# EAGLE design main-v2 (EAGLE 6.5.0)
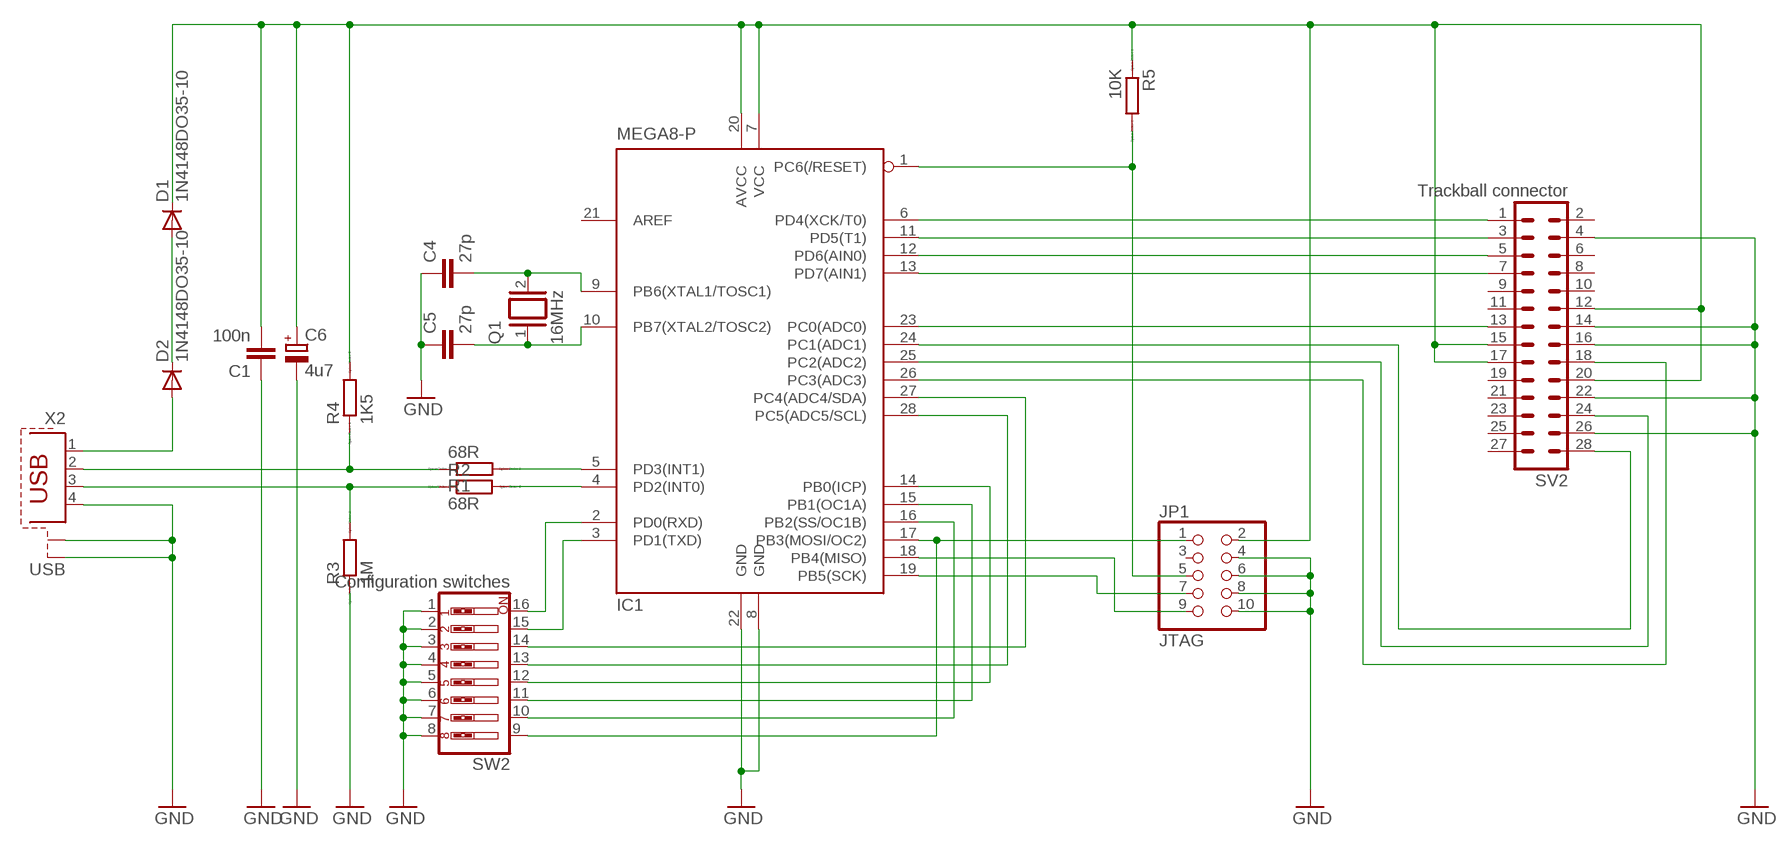
[diagram p0: schematic, sheet 1]

## Parts
C1  100n  C-EU025-025X050  [C025-025X050]
C4  27p  C-EU025-025X050  [C025-025X050]
C5  27p  C-EU025-025X050  [C025-025X050]
C6  4u7  CPOL-EUE2.5-5  [E2,5-5]
D1  1N4148DO35-10  [DO35-10]
D2  1N4148DO35-10  [DO35-10]
IC1  MEGA8-P  [DIL28-3]
JP1  JTAG  PINHD-2X5  [2X05]
Q1  16MHz  XTAL/S  [QS]
R1  68R  R0207/10  [0207/10]
R2  68R  R0207/10  [0207/10]
R3  1M  R0207/10  [0207/10]
R4  1K5  R0207/10  [0207/10]
R5  10K  R0207/10  [0207/10]
SV2  Trackball connector  MA14-214  [MA14-2]
SW2  Configuration switches  SW_DIP-8  [EDG-08]
X2  USB  PN61729-S  [PN61729-S]

## Nets
GND: C1.1 C4.1 C5.1 C6.- IC1.8(GND) IC1.22(GND) JP1.4 JP1.6 JP1.8 JP1.10 R3.1 SV2.4 SV2.14 SV2.16 SV2.22 SV2.26 SW2.1 SW2.2 SW2.3 SW2.4 SW2.5 SW2.6 SW2.7 SW2.8 X2.4 X2.S1 X2.S2
N$1: D1.A D2.C
N$3: IC1.5(PD3(INT1)) R1.2
N$4: IC1.4(PD2(INT0)) R2.2
N$5: R1.1 R4.1 X2.2
N$6: R2.1 R3.2 X2.3
N$8: IC1.12(PD6(AIN0)) SV2.5
N$9: C5.2 IC1.10(PB7(XTAL2/TOSC2)) Q1.1
N$10: C4.2 IC1.9(PB6(XTAL1/TOSC1)) Q1.2
N$12: IC1.11(PD5(T1)) SV2.3
N$13: IC1.6(PD4(XCK/T0)) SV2.1
N$14: IC1.23(PC0(ADC0)) SV2.13
N$15: IC1.13(PD7(AIN1)) SV2.7
N$16: IC1.25(PC2(ADC2)) SV2.24
N$17: IC1.26(PC3(ADC3)) SV2.18
N$18: IC1.1(PC6(/RESET)) JP1.5 R5.2
N$19: IC1.18(PB4(MISO)) JP1.9
N$20: IC1.19(PB5(SCK)) JP1.7
N$21: IC1.17(PB3(MOSI/OC2)) JP1.1 SW2.9
N$28: IC1.24(PC1(ADC1)) SV2.28
N$49: D2.A X2.1
N$50: IC1.16(PB2(SS/OC1B)) SW2.10
N$51: IC1.15(PB1(OC1A)) SW2.11
N$52: IC1.14(PB0(ICP)) SW2.12
N$53: IC1.2(PD0(RXD)) SW2.16
N$54: IC1.3(PD1(TXD)) SW2.15
N$55: IC1.27(PC4(ADC4/SDA)) SW2.14
N$56: IC1.28(PC5(ADC5/SCL)) SW2.13
VCC: C1.2 C6.+ D1.C IC1.7(VCC) IC1.20(AVCC) JP1.2 R4.2 R5.1 SV2.12 SV2.15 SV2.17 SV2.20
Unconnected: IC1.21(AREF) JP1.3 SV2.2 SV2.6 SV2.8 SV2.9 SV2.10 SV2.11 SV2.19 SV2.21 SV2.23 SV2.25 SV2.27

## Library data of the parts
C1 C4 C5 = rcl:C-EU: CAPACITOR, European symbol
C6 = rcl:CPOL-EU: POLARIZED CAPACITOR, European symbol
D1 D2 = diode:1N4148: DIODE high speed (Philips)
IC1 = atmel-mt:MEGA8-P: MICROCONTROLLER 8 Kbytes FLASH, 1 kbytes SRAM, 512 bytes EEPROM, USART, 4-channel 10 bit ADC, 2-channel 8 bit ADC Pin compatible with Atmega48, ATMega88, ATMega168 Source: avr.lbr; OC_FARNELL: unknown; OC_NEWARK: unknown
JP1 = pinhead:PINHD-2X5: PIN HEADER
Q1 = special:XTAL/S: CRYSTAL
R1-R5 = eagle-ltspice:R: RESISTOR, European symbol; SPICEMODEL: NONE; SPICEPREFIX: R
SV2 = con-lstb:MA14-2: PIN HEADER; OC_FARNELL: unknown; OC_NEWARK: unknown
SW2 = special:SW_DIP-8: DIP SWITCH
X2 = con-berg:PN61729-S: BERG USB connector; OC_FARNELL: unknown; OC_NEWARK: unknown

## Net classes
0 default: clearance 0.205 mm

## Board
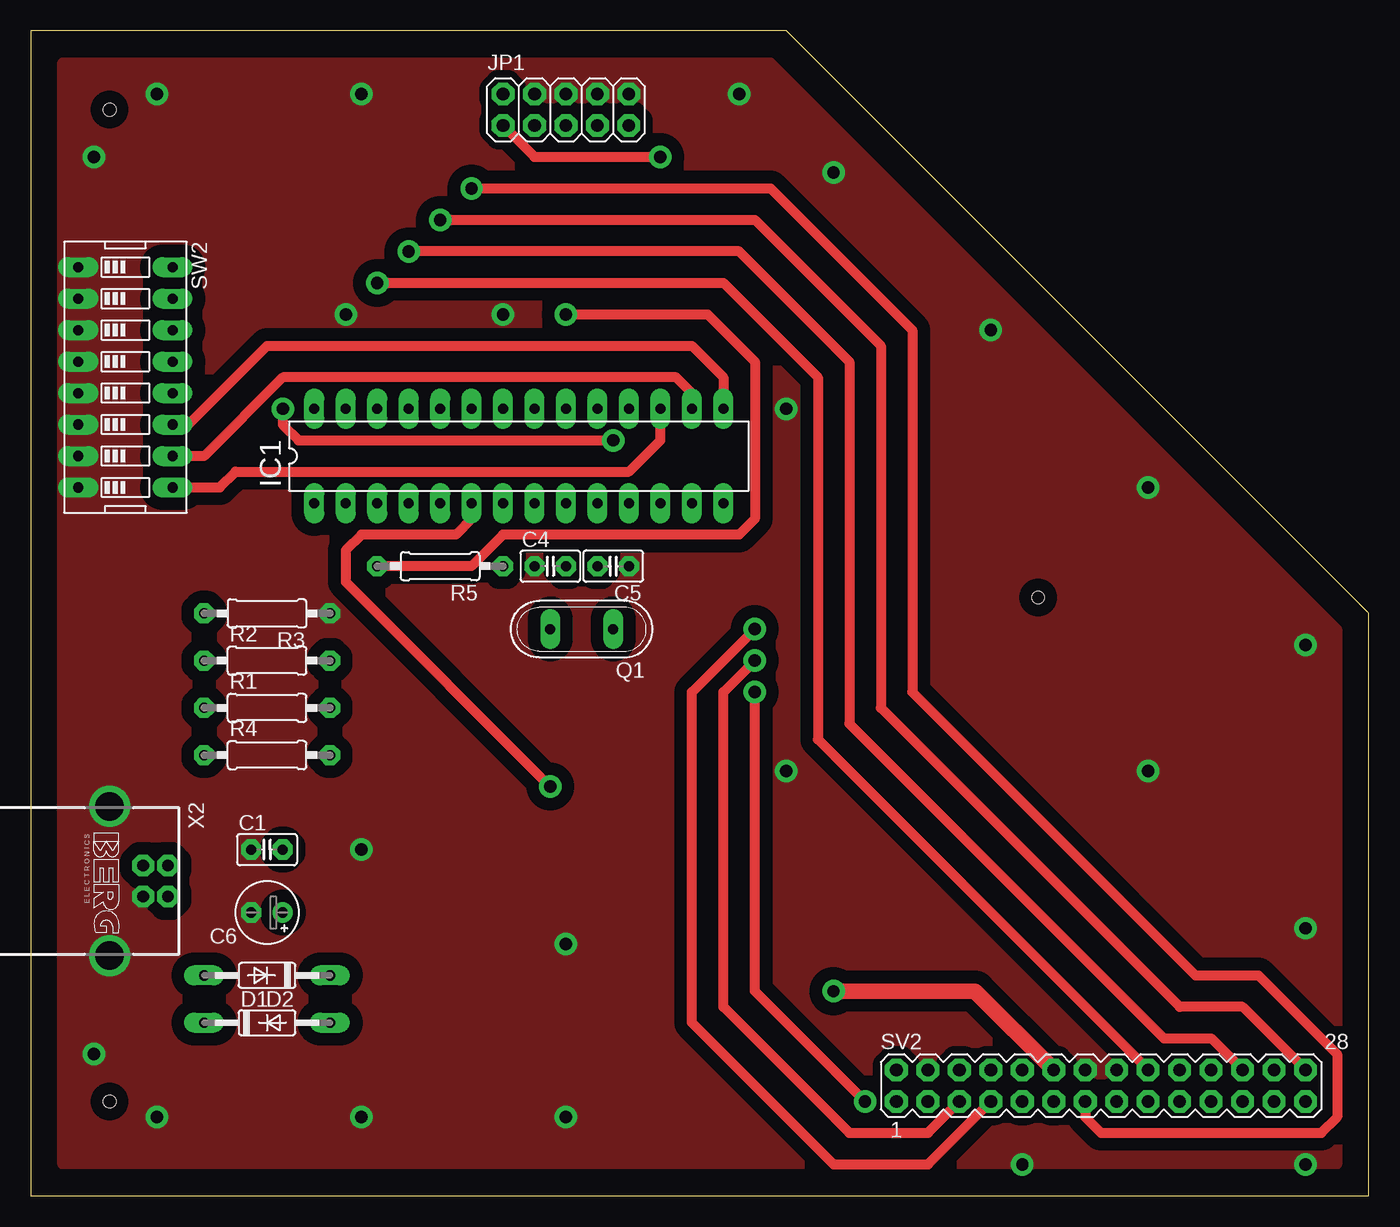
[diagram p1: board, top side]
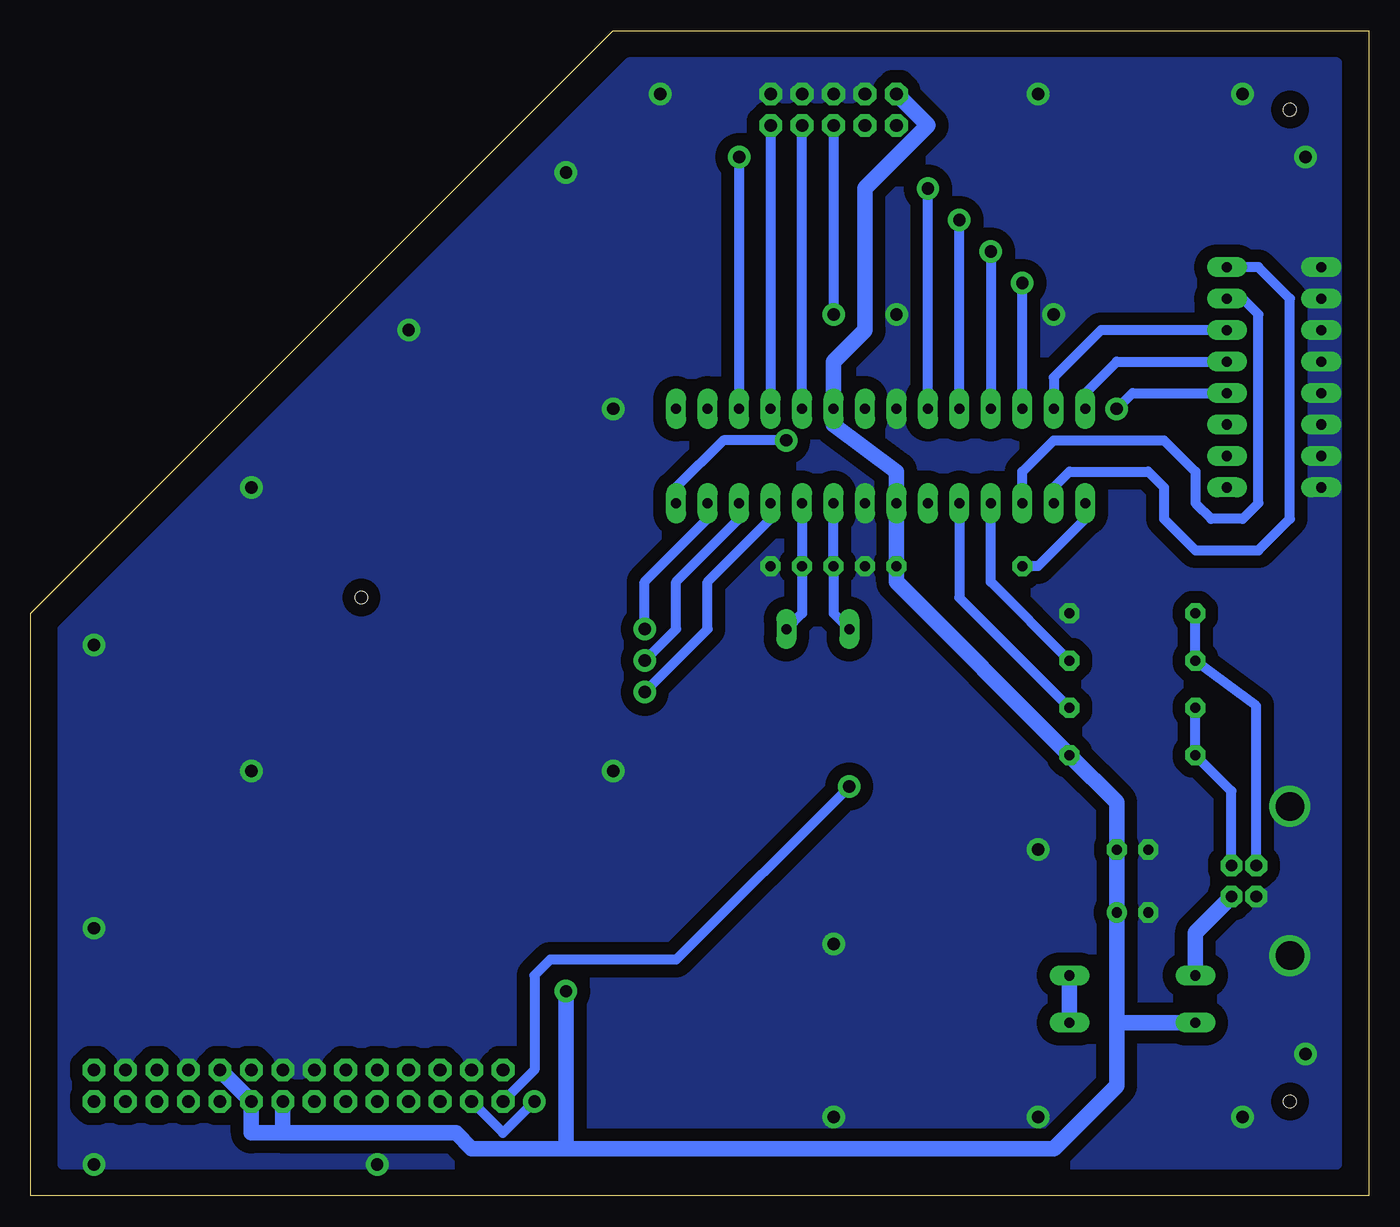
[diagram p2: board, bottom side, seen from below]

Size 107.95 x 93.98 mm. Coordinates in mm from the lower left corner, seen from the top.
Outline: 0,0 107.95,0 107.95,46.99 60.96,93.98 0,93.98 0,0
Copper layers (1*16): Top 0.035mm / dielectric 1.5mm / Bottom 0.035mm
Design rules "default *": minimum track width 10mil, minimum drill 0.8mm, track to track 8mil, track to pad 8mil, pad to pad 8mil, via to via 8mil, smd to smd 8mil, copper to edge 40mil, drill to drill 8mil, minimum pad ring 16mil, minimum via ring 16mil, stop-mask expansion 4mil, vias tented up to drill 0mil, thermal gap 10mil
Holes 1 mm at 6.35,87.63 6.35,7.62 81.28,48.26

### Footprints (pad centres in the part's own frame; a part is rotated, then mirrored left to right if it is on the bottom)
C025-025X050 = drill 0.813 octagon: 1 -1.27,0; 2 1.27,0
E2,5-5 = drill 0.813 pad 1.6: + -1.27,0 | drill 0.813 pad 1.6 octagon: - 1.27,0
DO35-10 = drill 0.813 long: A 5.08,0; C -5.08,0
DIL28-3 = drill 0.813 long: 1 -16.51,-3.81; 2 -13.97,-3.81; 3 -11.43,-3.81; 4 -8.89,-3.81; 5 -6.35,-3.81; 6 -3.81,-3.81; 7 -1.27,-3.81; 8 1.27,-3.81; 9 3.81,-3.81; 10 6.35,-3.81; 11 8.89,-3.81; 12 11.43,-3.81; 13 13.97,-3.81; 14 16.51,-3.81; 15 16.51,3.81; 16 13.97,3.81; 17 11.43,3.81; 18 8.89,3.81; 19 6.35,3.81; 20 3.81,3.81; 21 1.27,3.81; 22 -1.27,3.81; 23 -3.81,3.81; 24 -6.35,3.81; 25 -8.89,3.81; 26 -11.43,3.81; 27 -13.97,3.81; 28 -16.51,3.81
2X05 = drill 1.016 octagon: 1 -5.08,-1.27; 2 -5.08,1.27; 3 -2.54,-1.27; 4 -2.54,1.27; 5 0,-1.27; 6 0,1.27; 7 2.54,-1.27; 8 2.54,1.27; 9 5.08,-1.27; 10 5.08,1.27
QS = drill 0.8 long: 1 -2.54,0; 2 2.54,0
0207/10 = drill 0.813 octagon: 1 -5.08,0; 2 5.08,0
MA14-2 = drill 1.016 octagon: 1 -16.51,-1.27; 2 -16.51,1.27; 3 -13.97,-1.27; 4 -13.97,1.27; 5 -11.43,-1.27; 6 -11.43,1.27; 7 -8.89,-1.27; 8 -8.89,1.27; 9 -6.35,-1.27; 10 -6.35,1.27; 11 -3.81,-1.27; 12 -3.81,1.27; 13 -1.27,-1.27; 14 -1.27,1.27; 15 1.27,-1.27; 16 1.27,1.27; 17 3.81,-1.27; 18 3.81,1.27; 19 6.35,-1.27; 20 6.35,1.27; 21 8.89,-1.27; 22 8.89,1.27; 23 11.43,-1.27; 24 11.43,1.27; 25 13.97,-1.27; 26 13.97,1.27; 27 16.51,-1.27; 28 16.51,1.27
EDG-08 = drill 0.813 long: 1 -8.89,-3.81; 2 -6.35,-3.81; 3 -3.81,-3.81; 4 -1.27,-3.81; 5 1.27,-3.81; 6 3.81,-3.81; 7 6.35,-3.81; 8 8.89,-3.81; 9 8.89,3.81; 10 6.35,3.81; 11 3.81,3.81; 12 1.27,3.81; 13 -1.27,3.81; 14 -3.81,3.81; 15 -6.35,3.81; 16 -8.89,3.81
PN61729-S = drill 0.95 octagon: 1 1.25,4.71; 2 -1.25,4.71; 3 -1.25,2.71; 4 1.25,2.71 | drill 2.3 pad 2.9: S1 -6.02,0; S2 6.02,0

### Placement (x,y rotation side)
C1  19.05,27.94 0 top
C4  41.91,50.8 0 top
C5  46.99,50.8 180 top
C6  19.05,22.86 180 top
D1  19.05,13.97 0 top
D2  19.05,17.78 180 top
IC1  39.37,59.69 0 top
JP1  43.18,87.63 0 top
Q1  44.45,45.72 180 top
R1  19.05,39.37 0 top
R2  19.05,43.18 0 top
R3  19.05,46.99 180 top
R4  19.05,35.56 0 top
R5  33.02,50.8 180 top
SV2  86.36,8.89 0 top
SW2  7.62,66.04 270 top
X2  6.35,25.4 270 top

### Tracks (layer width: path | path; a pad name or v marks a point on that pad's centre or on a via)
GND  (via drill 1)
  other vias: 25.4,71.12 43.18,20.32 80.01,2.54 10.16,6.35 5.08,11.43 5.08,83.82 10.16,88.9 60.96,63.5 102.87,44.45 102.87,21.59 90.17,57.15 77.47,69.85 64.77,82.55 26.67,6.35 26.67,88.9 43.18,6.35 38.1,71.12 102.87,2.54 57.15,88.9 90.17,34.29 60.96,34.29 26.67,27.94
  pour Bottom (isolate 1.016, no thermals): 2.54,91.44 59.69,91.44 105.41,45.72 105.41,2.54 2.54,2.54
  pour Top (isolate 1.016, no thermals): 2.54,91.44 59.69,91.44 105.41,45.72 105.41,2.54 2.54,2.54
N$1
  Bottom 1.27: D2.C D1.A
N$3
  Bottom 0.813: IC1.5 33.02,48.26 R1.2
N$4
  Bottom 0.813: R2.2 30.48,49.53 IC1.4
N$5
  Bottom 0.813: R1.1 R4.1 11.06,32.65 X2.2
N$6
  Bottom 0.813: R3.2 R2.1 9.06,39.54 X2.3
N$8  (via drill 1)
  Top 0.813: SV2.5 72.39,5.08 66.04,5.08 55.88,15.24 55.88,40.64 v58.42,43.18
  Bottom 0.813: v58.42,43.18 55.88,45.72 55.88,49.53 50.8,54.61 IC1.12
N$9
  Bottom 0.813: IC1.10 C5.2 45.72,46.99 Q1.1
N$10
  Bottom 0.813: IC1.9 C4.2 43.18,46.99 Q1.2
N$12  (via drill 1)
  Top 0.813: v58.42,40.64 58.42,16.51 v67.31,7.62
  Bottom 0.813: v58.42,40.64 53.34,45.72 53.34,49.53 48.26,54.61 IC1.11 | SV2.3 69.85,5.08 v67.31,7.62
N$13  (via drill 1)
  Top 0.813: v41.91,33.02 25.4,49.53 25.4,52.07 26.67,53.34 34.29,53.34 35.56,54.61 IC1.6
  Bottom 0.813: v41.91,33.02 55.88,19.05 66.04,19.05 67.31,17.78 67.31,10.16 SV2.1
N$14  (via drill 1)
  Top 0.813: SV2.13 85.09,6.35 86.36,5.08 104.14,5.08 105.41,6.35 105.41,11.43 99.06,17.78 93.98,17.78 71.12,40.64 71.12,69.85 59.69,81.28 v35.56,81.28
  Bottom 0.813: IC1.23 v35.56,81.28
N$15  (via drill 1)
  Top 0.813: SV2.7 72.39,2.54 64.77,2.54 53.34,13.97 53.34,40.64 v58.42,45.72
  Bottom 0.813: v58.42,45.72 58.42,49.53 53.34,54.61 IC1.13
N$16  (via drill 1)
  Top 0.813: SV2.24 95.25,12.7 91.44,12.7 66.04,38.1 66.04,67.31 57.15,76.2 v30.48,76.2
  Bottom 0.813: v30.48,76.2 IC1.25
N$17  (via drill 1)
  Top 0.813: v27.94,73.66 55.88,73.66 63.5,66.04 63.5,36.83 SV2.18
  Bottom 0.813: IC1.26 v27.94,73.66
N$18  (via drill 1)
  Top 0.813: v43.18,71.12 54.61,71.12 58.42,67.31 58.42,54.61 57.15,53.34 38.1,53.34 35.56,50.8 R5.2
  Bottom 0.813: JP1.5 v43.18,71.12 | IC1.1 22.86,54.61 26.67,50.8 R5.2
N$19
  Bottom 0.813: JP1.9 IC1.18
N$20
  Bottom 0.813: IC1.19 JP1.7
N$21  (via drill 1)
  Top 0.813: IC1.17 50.8,60.96 48.26,58.42 16.51,58.42 15.24,57.15 SW2.9 | JP1.1 40.64,83.82 v50.8,83.82
  Bottom 0.813: v50.8,83.82 IC1.17
N$28  (via drill 1)
  Top 0.813: v33.02,78.74 58.42,78.74 68.58,68.58 68.58,39.37 92.71,15.24 97.79,15.24 SV2.28
  Bottom 0.813: IC1.24 v33.02,78.74
N$49
  Bottom 1.27: D2.A 13.97,21.24 X2.1
N$50
  Top 0.813: IC1.16 53.34,64.77 52.07,66.04 20.32,66.04 13.97,59.69 SW2.10
N$51
  Top 0.813: SW2.11 12.7,62.23 19.05,68.58 53.34,68.58 55.88,66.04 IC1.15
N$52  (via drill 1)
  Top 0.813: v20.32,63.5 20.32,62.23 21.59,60.96 v46.99,60.96
  Bottom 0.813: v46.99,60.96 52.07,60.96 55.88,57.15 IC1.14 | v20.32,63.5 19.05,64.77 SW2.12
N$53
  Bottom 0.813: IC1.2 25.4,57.15 24.13,58.42 17.78,58.42 16.51,57.15 16.51,54.61 13.97,52.07 8.89,52.07 6.35,54.61 6.35,72.39 8.89,74.93 SW2.16
N$54
  Bottom 0.813: IC1.3 27.94,58.42 25.4,60.96 16.51,60.96 13.97,58.42 13.97,55.88 12.7,54.61 10.16,54.61 8.89,55.88 8.89,71.12 10.16,72.39 SW2.15
N$55
  Bottom 0.813: SW2.14 21.59,69.85 25.4,66.04 IC1.27
N$56
  Bottom 0.813: IC1.28 22.86,64.77 20.32,67.31 SW2.13
VCC  (via drill 1)
  Top 1.27: SV2.12 76.2,16.51 v64.77,16.51
  Bottom 1.27: JP1.2 35.56,86.36 40.64,81.28 40.64,69.85 43.18,67.31 IC1.20 43.18,62.23 38.1,58.42 IC1.7 R5.1 38.1,49.53 R4.2 20.32,31.75 C1.2 C6.+ 20.32,13.97 | SV2.20 SV2.17 90.17,5.08 87.63,5.08 | SV2.15 87.63,5.08 | 87.63,5.08 73.66,5.08 72.39,3.81 64.77,3.81 | 64.77,3.81 25.4,3.81 20.32,8.89 20.32,13.97 | v64.77,16.51 64.77,3.81 | 20.32,13.97 D1.C